# EAGLE design simreader_marble_hammi_FT230X (EAGLE 6.6.0)
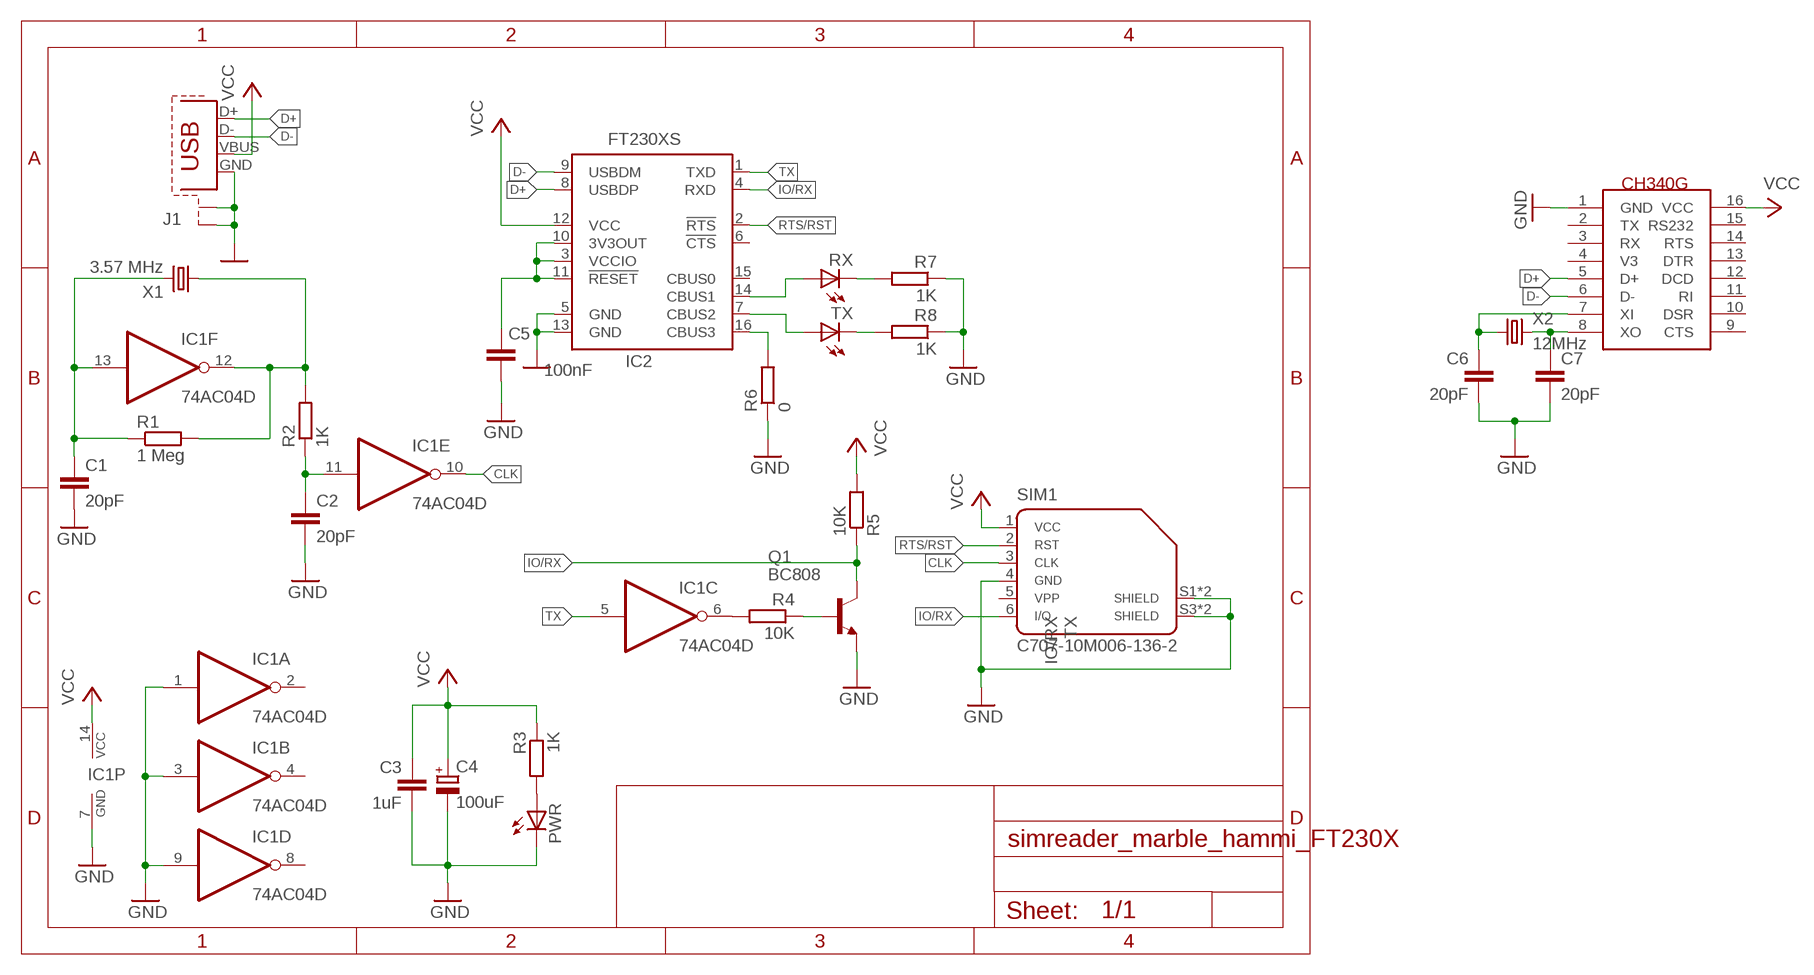
[diagram p0: schematic, sheet 1]

## Parts
C1  20pF  C-EUC0603  [C0603]
C2  20pF  C-EUC0603  [C0603]
C3  1uF  C-EUC0603  [C0603]
C4  100uF  CPOL-EU140CLH-0810  [140CLH-0810]
C5  100nF  C-EUC0603  [C0603]
C6  20pF  C-EUC0603  [C0603]
C7  20pF  C-EUC0603  [C0603]
IC1  74AC04D  [SO14]
IC2  FT230XS  [SSOP-16]
J1  USB-SHIELD-A-H  [USB-A-H]
PWR  LEDCHIPLED_0603  [CHIPLED_0603]
Q1  BC808  BC808-NPN-SOT23-BEC  [SOT23-BEC]
R1  1 Meg  R-EU_R0603  [R0603]
R2  1K  R-EU_R0603  [R0603]
R3  1K  R-EU_R0603  [R0603]
R4  10K  R-EU_R0603  [R0603]
R5  10K  R-EU_R0603  [R0603]
R6  0  R-EU_R0603  [R0603]
R7  1K  R-EU_R0603  [R0603]
R8  1K  R-EU_R0603  [R0603]
RX  LEDCHIPLED_0603  [CHIPLED_0603]
SIM1  C707-10M006-136-2  [C707_10M006_136_2]
TX  LEDCHIPLED_0603  [CHIPLED_0603]
U$1  CH340G  [CH340G]
X1  3.57 MHz  CRYSTALHC49UP  [HC49UP]
X2  12MHz  CRYSTALHC49UP  [HC49UP]

## Nets
CLK: IC1.10(E:O) SIM1.3
D+: IC2.8(USBDP) J1.D+ U$1.5(D+)
D-: IC2.9(USBDM) J1.D- U$1.6(D-)
GND: C1.2 C2.2 C3.2 C4.- C5.2 C6.2 C7.2 IC1.1(A:I) IC1.3(B:I) IC1.7(P:GND) IC1.9(D:I) IC2.5(GND) IC2.13(GND) J1.GND J1.GND2(S1) J1.GND3(S2) PWR.C Q1.E R6.1 R7.1 R8.1 SIM1.4 SIM1.S1 SIM1.S2(S1) SIM1.S3(S2) SIM1.S4(S2) U$1.1(GND)
IO/RX: IC2.4(RXD) Q1.C R5.1 SIM1.6
N$1: C1.1 IC1.13(F:I) R1.1 X1.2
N$2: IC1.12(F:O) R1.2 R2.2 X1.1
N$3: C2.1 IC1.11(E:I) R2.1
N$4: IC1.6(C:O) R4.2
N$6: Q1.B R4.1
N$13: PWR.A R3.2
N$26: C6.1 U$1.7(XI) X2.1
N$27: C7.1 U$1.8(XO) X2.2
N$28: C5.1 IC2.3(VCCIO) IC2.10(3V3OUT) IC2.11(!RESET)
N$29: IC2.16(CBUS3) R6.2
N$30: IC2.14(CBUS1) RX.A
N$31: IC2.7(CBUS2) TX.A
N$32: R7.2 RX.C
N$33: R8.2 TX.C
RTS/RST: IC2.2(!RTS) SIM1.2
TX: IC1.5(C:I) IC2.1(TXD)
VCC: C3.1 C4.+ IC1.14(P:VCC) IC2.12(VCC) J1.VBUS R3.1 R5.2 SIM1.1 U$1.16(VCC)
Unconnected: IC1.2(A:O) IC1.4(B:O) IC1.8(D:O) IC2.6(!CTS) IC2.15(CBUS0) SIM1.5 U$1.2(TX) U$1.3(RX) U$1.4(V3) U$1.9(CTS) U$1.10(DSR) U$1.11(RI) U$1.12(DCD) U$1.13(DTR) U$1.14(RTS) U$1.15(RS232)

## Library data of the parts
C1-C3 C5-C7 = rcl:C-EU: CAPACITOR, European symbol
C4 = rcl:CPOL-EU: POLARIZED CAPACITOR, European symbol
IC1 = 74xx-eu:74*04: Hex INVERTER
IC2 = ftdichip:FT230X
J1 = obddiag-net:USB-SHIELD
PWR RX TX = led:LED: LED OSRAM: - CHIPLED LG R971, LG N971, LY N971, LG Q971, LY Q971, LO R971, LY R971 LH N974, LH R974 LS Q976, LO Q976, LY Q976 LO Q996 - Hyper CHIPLED LW Q18S LB Q993, LB Q99A, LB R99A - SideLED LS A670, LO A670, LY A670, LG A670, LP A670 LB A673, LV A673, LT A673, LW A673 LH A674 LY A675 LS A676, LA A676, LO A676, LY A676, LW A676 LS A679, LY A679, LG A679 - Hyper Micro SIDELED® LS Y876, LA Y876, LO Y876, LY Y876 LT Y87S - SmartLED LW L88C, LW L88S LB L89C, LB L89S, LG L890 LS L89K, LO L89K, LY L89K LS L896, LA L896, LO L896, LY L896 - TOPLED LS T670, LO T670, LY T670, LG T670, LP T670 LSG T670, LSP T670, LSY T670, LOP T670, LYG T670 LG T671, LOG T671, LSG T671 LB T673, LV T673, LT T673, LW T673 LH T674 LS T676, LA T676, LO T676, LY T676, LB T676, LH T676, LSB T676, LW T676 LB T67C, LV T67C, LT T67C, LS T67K, LO T67K, LY T67K, LW E67C LS E67B, LA E67B, LO E67B, LY E67B, LB E67C, LV E67C, LT E67C LW T67C LS T679, LY T679, LG T679 LS T770, LO T770, LY T770, LG T770, LP T770 LB T773, LV T773, LT T773, LW T773 LH T774 LS E675, LA E675, LY E675, LS T675 LS T776, LA T776, LO T776, LY T776, LB T776 LHGB T686 LT T68C, LB T68C - Hyper Mini TOPLED® LB M676 - Mini TOPLED Santana® LG M470 LS M47K, LO M47K, LY M47K Source: http://www.osram.convergy.de LUXEON: - LUMILED® LXK2-PW12-R00, LXK2-PW12-S00, LXK2-PW14-U00, LXK2-PW14-V00 LXK2-PM12-R00, LXK2-PM12-S00, LXK2-PM14-U00 LXK2-PE12-Q00, LXK2-PE12-R00, LXK2-PE12-S00, LXK2-PE14-T00, LXK2-PE14-U00 LXK2-PB12-K00, LXK2-PB12-L00, LXK2-PB12-M00, LXK2-PB14-N00, LXK2-PB14-P00, LXK2-PB14-Q00 LXK2-PR12-L00, LXK2-PR12-M00, LXK2-PR14-Q00, LXK2-PR14-R00 LXK2-PD12-Q00, LXK2-PD12-R00, LXK2-PD12-S00 LXK2-PH12-R00, LXK2-PH12-S00 LXK2-PL12-P00, LXK2-PL12-Q00, LXK2-PL12-R00 Source: www.luxeon.com KINGBRIGHT: KA-3528ASYC Source: www.kingbright.com
Q1 = transistor:*-NPN-: NPN Transistror BF959 corrected 2008.03.06
R1-R8 = rcl:R-EU_: RESISTOR, European symbol
SIM1 = con-amphenol:C707-10M006-136-2
U$1 = dan:CH340G
X1 X2 = crystal:CRYSTAL: CRYSTAL; OC_FARNELL: unknown; OC_NEWARK: unknown

## Board
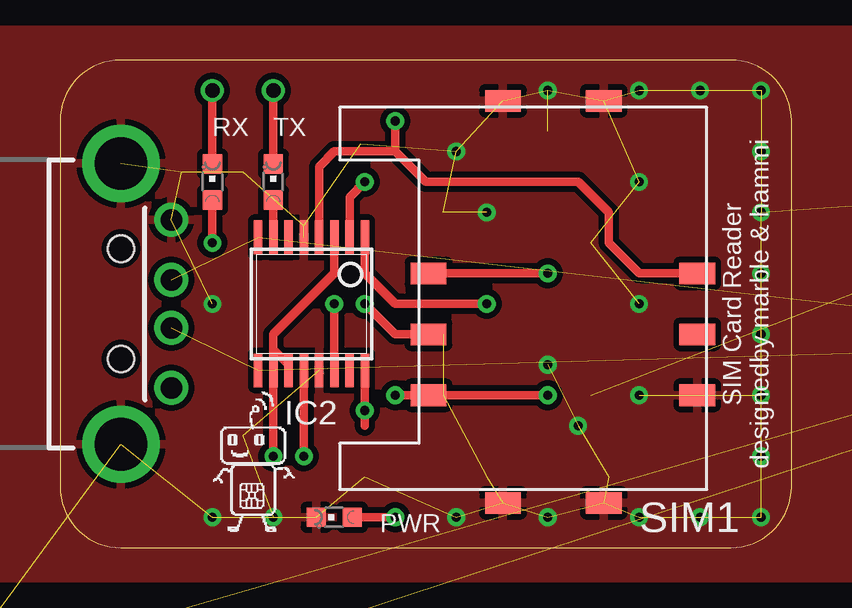
[diagram p1: board, top side]
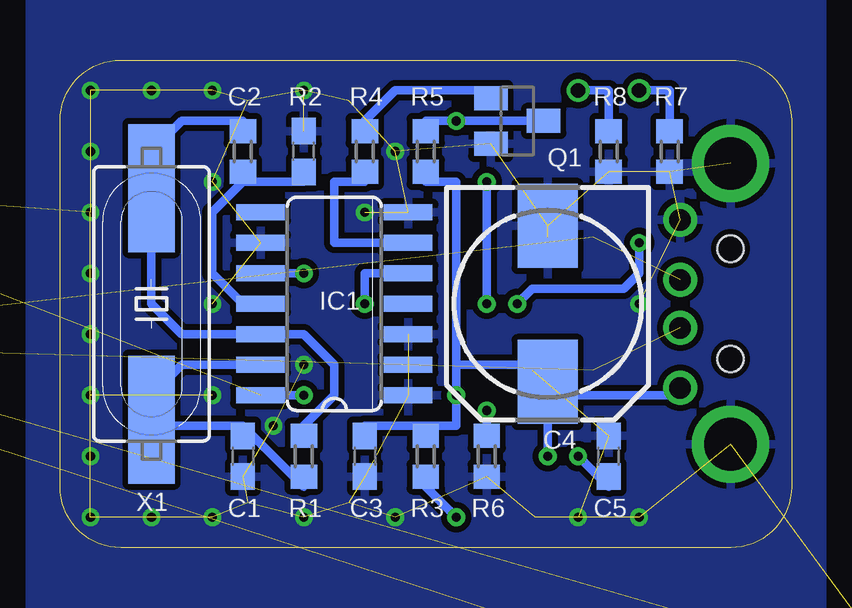
[diagram p2: board, bottom side, seen from below]

Size 30.48 x 20.32 mm. Coordinates in mm from the lower left corner, seen from the top.
Outline: 0,17.78 0,2.54 arc90 2.54,0 27.94,0 arc90 30.48,2.54 30.48,17.78 arc90 27.94,20.32 2.54,20.32 arc90 0,17.78
Copper layers (1*16): Top 0.035mm / dielectric 1.5mm / Bottom 0.035mm
Design rules "oshpark": minimum track width 6mil, minimum drill 13mil, track to track 6mil, track to pad 6mil, pad to pad 6mil, via to via 6mil, smd to smd 6mil, copper to edge 0mil, drill to drill 8mil, minimum pad ring 10mil, minimum via ring 7mil, stop-mask expansion 4mil, vias tented up to drill 100mil, thermal gap 10mil

### Footprints (pad centres in the part's own frame; a part is rotated, then mirrored left to right if it is on the bottom)
C0603 = smd 1.1 x 1: 1 -0.85,0; 2 0.85,0
140CLH-0810 = smd 3.5 x 2.5: + 3.25,0; - -3.25,0
SO14 = smd 0.66 x 2.032: 1 -3.81,-3.073; 2 -2.54,-3.073; 3 -1.27,-3.073; 4 0,-3.073; 5 1.27,-3.073; 6 2.54,-3.073; 7 3.81,-3.073; 8 3.81,3.073; 9 2.54,3.073; 10 1.27,3.073; 11 0,3.073; 12 -1.27,3.073; 13 -2.54,3.073; 14 -3.81,3.073
SSOP-16 = smd 0.35 x 1.4: 1 -2.223,-2.775; 2 -1.587,-2.775; 3 -0.953,-2.775; 4 -0.318,-2.775; 5 0.318,-2.775; 6 0.953,-2.775; 7 1.587,-2.775; 8 2.223,-2.775; 9 2.223,2.775; 10 1.587,2.775; 11 0.953,2.775; 12 0.318,2.775; 13 -0.318,2.775; 14 -0.953,2.775; 15 -1.587,2.775; 16 -2.223,2.775
USB-A-H = drill 0.9: D+ 2.1,1; D- 2.1,-1; GND 2.1,3.5; VBUS 2.1,-3.5 | drill 2.2: GND2 0,-5.85; GND3 0,5.85 | hole 1.1: 0,2.3; 0,-2.3
CHIPLED_0603 = smd 0.8 x 0.8: A 0,-0.75; C 0,0.75
SOT23-BEC = smd 1 x 1.4: B -0.95,-1.1; C 0,1.1; E 0.95,-1.1
R0603 = smd 1 x 1.1: 1 -0.85,0; 2 0.85,0
C707_10M006_136_2 = smd 1.49 x 0.9: 1 4.965,2.54; 2 4.965,0; 3 4.965,-2.54; 4 -6.235,2.54; 5 -6.235,0; 6 -6.235,-2.54; S1 -2.335,7.02; S2 1.865,7.02; S3 -2.335,-9.73; S4 1.865,-9.73
CH340G = smd 0.635 x 1.524: 1 -4.445,-2.695; 2 -3.175,-2.695; 3 -1.905,-2.695; 4 -0.635,-2.695; 5 0.635,-2.695; 6 1.905,-2.695; 7 3.175,-2.695; 8 4.445,-2.695; 9 4.445,2.695; 10 3.175,2.695; 11 1.905,2.695; 12 0.635,2.695; 13 -0.635,2.695; 14 -1.905,2.695; 15 -3.175,2.695; 16 -4.445,2.695
HC49UP = smd 5.334 x 1.93: 1 -4.826,0; 2 4.826,0

### Placement (x,y rotation side)
C1  22.86,3.81 270 bottom
C2  20.32,16.51 90 bottom
C3  17.78,3.81 270 bottom
C4  10.16,10.16 270 bottom
C5  7.62,3.81 90 bottom
C6  -12.7,-15.24 0 top  (outside the outline)
C7  -12.7,-20.32 0 top  (outside the outline)
IC1  19.05,10.16 90 bottom
IC2  10.48,10.16 180 top
J1  2.54,10.16 0 top
PWR  11.43,1.27 90 top
Q1  11.43,17.78 270 bottom
R1  20.32,3.81 90 bottom
R2  22.86,16.51 90 bottom
R3  15.24,3.81 270 bottom
R4  17.78,16.51 270 bottom
R5  15.24,16.51 270 bottom
R6  12.7,3.81 90 bottom
R7  5.08,16.51 90 bottom
R8  7.62,16.51 90 bottom
RX  6.35,15.24 0 top
SIM1  20.32,8.89 180 top
TX  8.89,15.24 0 top
U$1  40.64,10.16 270 top  (outside the outline)
X1  26.67,10.16 270 bottom
X2  -7.62,-7.62 0 top  (outside the outline)

### Tracks (layer width: path | path; a pad name or v marks a point on that pad's centre or on a via)
CLK  (via drill 0.38)
  Top 0.356: v20.32,11.43 SIM1.3
  Bottom 0.356: IC1.10 v20.32,11.43
D+  (2 unrouted)
D-  (2 unrouted)
GND  (via drill 0.38)  (51 unrouted)
  other vias: 20.32,7.62 21.59,5.08 24.13,6.35 24.13,15.24 24.13,10.16 6.35,1.27 29.21,1.27 29.21,19.05 20.32,1.27 20.32,19.05 24.13,1.27 24.13,19.05 16.51,1.27 26.67,19.05 29.21,16.51 29.21,13.97 29.21,11.43 29.21,8.89 29.21,6.35 29.21,3.81 26.67,1.27 16.51,16.51 17.78,13.97 6.35,10.16 8.89,1.27
  pour Top (isolate 0.254): -2.54,-1.27 33.02,-1.27 33.02,21.59 -2.54,21.59
  pour Bottom (isolate 0.254): -1.27,-2.54 31.75,-2.54 31.75,22.86 -1.27,22.86
IO/RX  (via drill 0.38)
  Top 0.356: SIM1.6 24.13,11.43 22.86,12.7 22.86,13.97 21.59,15.24 15.24,15.24 13.97,16.51 | IC2.4 10.79,15.88 11.43,16.51 13.97,16.51 | v13.97,17.78 13.97,16.51
  Bottom 0.356: Q1.C v13.97,17.78 15.24,17.78 R5.1
N$1
  Bottom 0.356: 22.86,5.08 26.67,5.08 X1.2 26.67,6.35 25.4,7.62 IC1.13 | R1.1 20.32,2.54 22.86,5.08 | 22.86,5.08 C1.1
N$2
  Bottom 0.356: R1.2 20.32,5.08 19.05,6.35 19.05,7.62 20.32,8.89 IC1.12 25.4,8.89 26.67,10.16 X1.1 26.67,16.51 25.4,17.78 22.86,17.78 R2.2
N$3
  Bottom 0.356: IC1.11 22.86,10.16 24.13,11.43 24.13,13.97 22.86,15.24 | C2.1 20.32,15.24 22.86,15.24 | R2.1 22.86,15.24
N$4
  Bottom 0.356: IC1.6 19.05,12.7 19.05,15.24 17.78,15.24 R4.2
N$6
  Bottom 0.356: R4.1 17.78,17.78 16.51,19.05 12.7,19.05 12.53,18.88 Q1.B
N$13  (via drill 0.38)
  Top 0.356: PWR.A v13.97,1.27
  Bottom 0.356: R3.2 15.24,2.54 v13.97,1.27
N$26  (2 unrouted)
N$27  (2 unrouted)
N$28  (via drill 0.38)
  Top 0.356: 8.89,8.26 IC2.10 v8.89,3.81 | IC2.11 9.53,7.62 8.89,8.26 | 8.89,8.26 8.89,8.89 11.43,11.43 IC2.3
  Bottom 0.356: v8.89,3.81 7.62,2.54 C5.1
N$29  (via drill 0.38)
  Top 0.356: IC2.16 v12.7,5.71 12.7,5.08
  Bottom 0.356: v12.7,5.71 R6.2
N$30  (via drill 0.38)
  Top 0.356: IC2.14 v11.43,10.16 | RX.A v6.35,12.7
  Bottom 0.356: v11.43,10.16 10.79,10.79 6.99,10.79 6.35,11.43 v6.35,12.7
N$31
  Top 0.356: TX.A IC2.7
N$32  (via drill 0.6)
  Top 0.356: v6.35,19.05 RX.C
  Bottom 0.356: R7.2 5.08,19.05 v6.35,19.05
N$33  (via drill 0.6)
  Top 0.356: v8.89,19.05 TX.C
  Bottom 0.356: R8.2 7.62,19.05 v8.89,19.05
RTS/RST  (via drill 0.38)
  Top 0.356: v12.7,10.16 13.97,8.89 SIM1.2 | IC2.2 12.06,14.61 v12.7,15.24
  Bottom 0.356: v12.7,15.24 v12.7,10.16
TX  (via drill 0.38)
  Top 0.356: v17.78,10.16 13.97,10.16 12.7,11.43 IC2.1
  Bottom 0.356: v17.78,10.16 17.78,11.43 IC1.5 15.24,11.43
VCC  (via drill 0.38)  (1 unrouted)
  Top 0.356: v13.97,6.35 SIM1.1 v20.32,6.35 | IC2.12 v10.16,3.81
  Bottom 0.356: IC1.14 v20.32,6.35 | C3.1 17.78,5.08 15.24,5.08 | 15.24,5.08 R3.1 | C4.+ 10.16,7.62 13.97,7.62 | 15.24,5.08 13.97,5.08 v13.97,6.35 13.97,7.62 | 13.97,7.62 13.97,15.24 15.24,15.24 R5.2 | C4.+ 10.16,6.35 4.95,6.35 J1.VBUS | C4.+ v10.16,3.81

### Text on the board
tNames: SIM Card Reader / designedby marble & hammi